# EAGLE design open dmx v.3 (EAGLE 5.06)
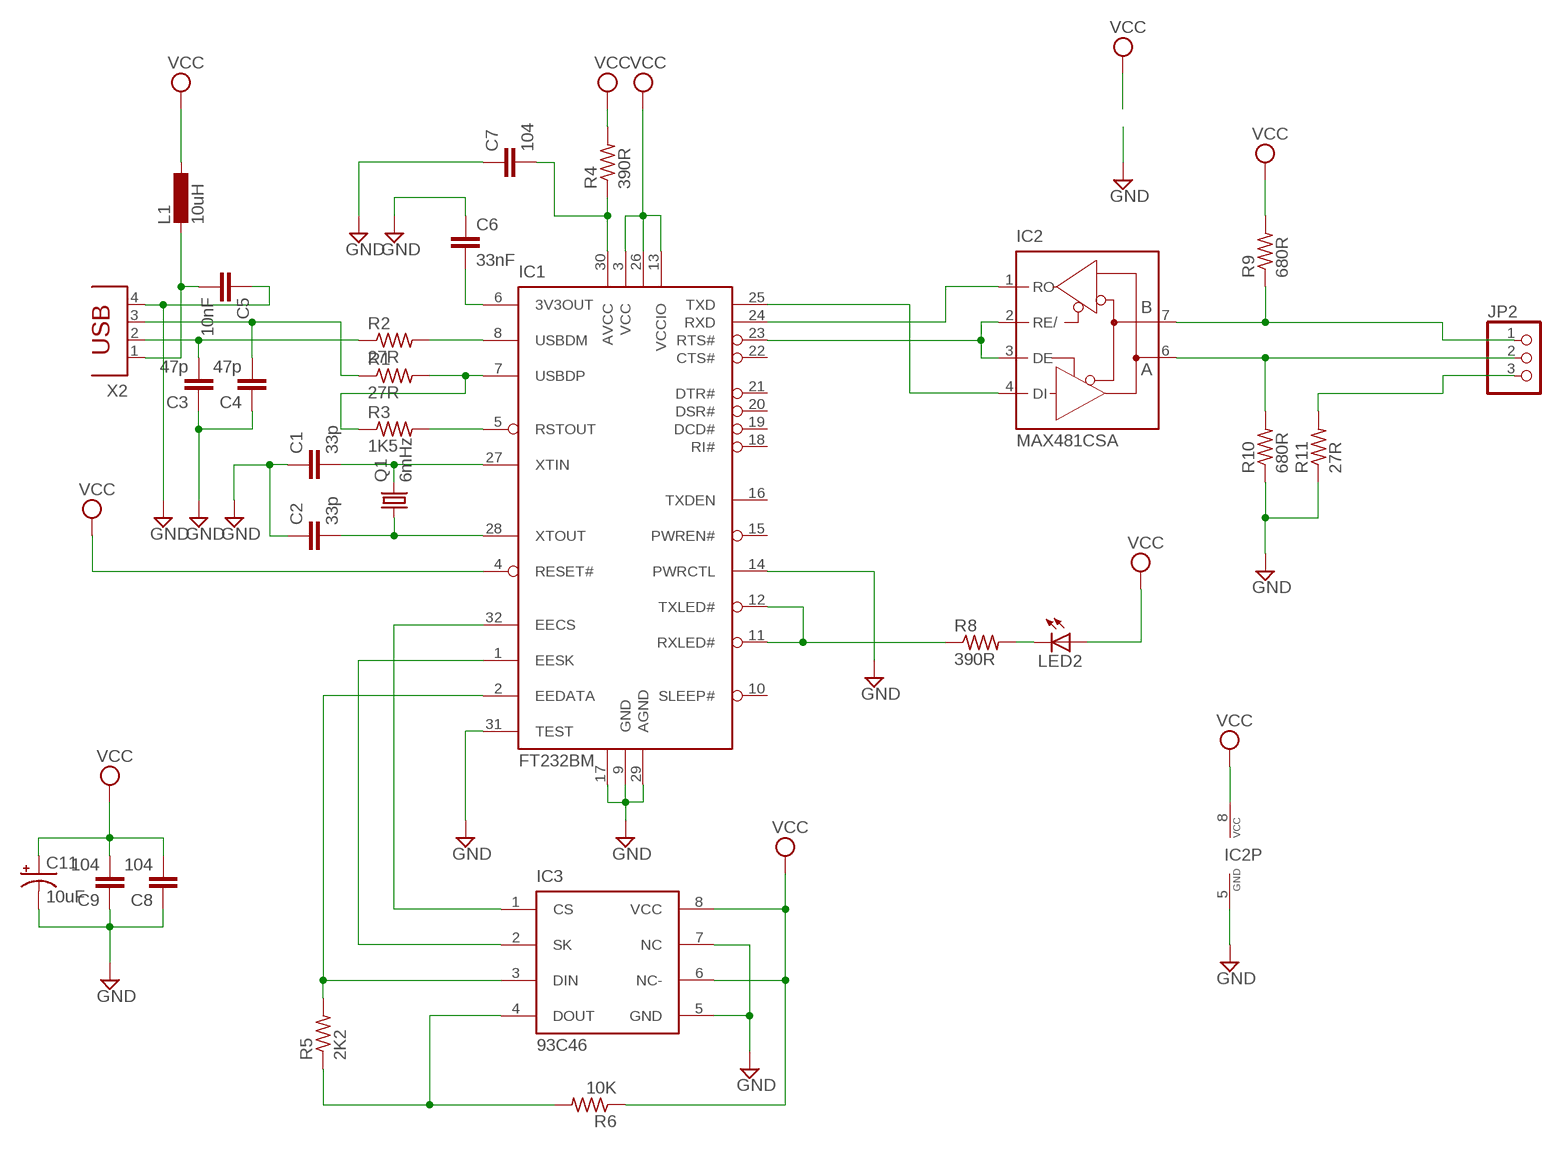
[diagram p0: schematic, sheet 1]

## Parts
C1  33p  C-EUC3216  [C3216]
C2  33p  C-EUC3216  [C3216]
C3  47p  C-EUC3216  [C3216]
C4  47p  C-EUC3216  [C3216]
C5  10nF  C-EUC3216  [C3216]
C6  33nF  C-EUC3216  [C3216]
C7  104  C-EUC3216  [C3216]
C8  104  C-EUC3216  [C3216]
C9  104  C-EUC3216  [C3216]
C11  10uF  CPOL-US153CLV-0605  [153CLV-0605]
IC1  FT232BM  [32LQFP]
IC2  MAX481CSA  [SO08]
IC3  93C46  [SO08]
JP2  PINHD-1X3  [1X03]
L1  10uH  L-EUL3225M  [L3225M]
LED2  LEDCHIPLED_1206  [CHIPLED_1206]
Q1  6mHz  CRYSTALHC49UP  [HC49UP]
R1  27R  R-US_R3216  [R3216]
R2  27R  R-US_R3216  [R3216]
R3  1K5  R-US_R3216  [R3216]
R4  390R  R-US_R3216  [R3216]
R5  2K2  R-US_R3216  [R3216]
R6  10K  R-US_R3216  [R3216]
R8  390R  R-US_R3216  [R3216]
R9  680R  R-US_R3216  [R3216]
R10  680R  R-US_R3216  [R3216]
R11  27R  R-US_R3216  [R3216]
X2  PN61729  [PN61729]

## Nets
GND: C1.1 C2.1 C3.1 C4.1 C5.1 C6.1 C7.1 C8.1 C9.1 C11.- IC1.9(GND) IC1.14(PWRCTL) IC1.17(GND2) IC1.29(AGND) IC1.31(TEST) IC2.5(GND) IC3.5(GND) IC3.7(NC) R10.1 R11.1 X2.4
N$1: C1.2 IC1.27(XTIN) Q1.2
N$2: C2.2 IC1.28(XTOUT) Q1.1
N$3: C4.2 R1.1 X2.3
N$4: IC1.8(USBDM) R2.2
N$5: C3.2 R2.1 X2.2
N$6: IC1.7(USBDP) R1.2 R3.1
N$7: IC1.5(RSTOUT) R3.2
N$8: C5.2 L1.2 X2.1
N$9: C6.2 IC1.6(3V3OUT)
N$11: C7.2 IC1.30(AVCC) R4.1
N$14: IC1.32(EECS) IC3.1(CS)
N$15: IC1.1(EESK) IC3.2(SK)
N$16: IC1.2(EEDATA) IC3.3(DIN) R5.2
N$17: IC3.4(DOUT) R5.1 R6.2
N$21: IC1.11(RXLED#) IC1.12(TXLED#) R8.1
N$22: LED2.C R8.2
N$24: IC1.23(RTS#) IC2.2(RE/) IC2.3(DE)
N$25: IC1.25(TXD) IC2.4(DI)
N$26: IC1.24(RXD) IC2.1(RO)
N$27: IC2.6(A) JP2.2 R10.2
N$28: JP2.3 R11.2
N$29: IC2.7(B) JP2.1 R9.1
VCC: C8.2 C9.2 C11.+ IC1.3(VCC) IC1.4(RESET#) IC1.13(VCCIO) IC1.26(VCC2) IC2.8(VCC) IC3.6(NC-) IC3.8(VCC) L1.1 LED2.A R4.2 R6.1 R9.2
Unconnected: IC1.10(SLEEP#) IC1.15(PWREN#) IC1.16(TXDEN) IC1.18(RI#) IC1.19(DCD#) IC1.20(DSR#) IC1.21(DTR#) IC1.22(CTS#)

## Library data of the parts
C1-C9 = rcl:C-EU: CAPACITOR, European symbol
C11 = rcl:CPOL-US: POLARIZED CAPACITOR, American symbol
IC1 = ftdi4:FT232BM
IC2 = maxim:MAX481CSA: RS485 TRANSEIVER
IC3 = ftdi4:93C46: Serial EEPROM
JP2 = pinhead:PINHD-1X3: PIN HEADER
L1 = rcl:L-EU: INDUCTOR, European symbol
LED2 = led:LED: LED OSRAM: - CHIPLED LG R971, LG N971, LY N971, LG Q971, LY Q971, LO R971, LY R971 LH N974, LH R974 LS Q976, LO Q976, LY Q976 LO Q996 - Hyper CHIPLED LW Q18S LB Q993, LB Q99A, LB R99A - SideLED LS A670, LO A670, LY A670, LG A670, LP A670 LB A673, LV A673, LT A673, LW A673 LH A674 LY A675 LS A676, LA A676, LO A676, LY A676, LW A676 LS A679, LY A679, LG A679 - Hyper Micro SIDELED® LS Y876, LA Y876, LO Y876, LY Y876 LT Y87S - SmartLED LW L88C, LW L88S LB L89C, LB L89S, LG L890 LS L89K, LO L89K, LY L89K LS L896, LA L896, LO L896, LY L896 - TOPLED LS T670, LO T670, LY T670, LG T670, LP T670 LSG T670, LSP T670, LSY T670, LOP T670, LYG T670 LG T671, LOG T671, LSG T671 LB T673, LV T673, LT T673, LW T673 LH T674 LS T676, LA T676, LO T676, LY T676, LB T676, LH T676, LSB T676, LW T676 LB T67C, LV T67C, LT T67C, LS T67K, LO T67K, LY T67K, LW E67C LS E67B, LA E67B, LO E67B, LY E67B, LB E67C, LV E67C, LT E67C LW T67C LS T679, LY T679, LG T679 LS T770, LO T770, LY T770, LG T770, LP T770 LB T773, LV T773, LT T773, LW T773 LH T774 LS E675, LA E675, LY E675, LS T675 LS T776, LA T776, LO T776, LY T776, LB T776 LHGB T686 LT T68C, LB T68C - Hyper Mini TOPLED® LB M676 - Mini TOPLED Santana® LG M470 LS M47K, LO M47K, LY M47K Source: http://www.osram.convergy.de - LUMILED® LXK2-PW12-R00, LXK2-PW12-S00, LXK2-PW14-U00, LXK2-PW14-V00 LXK2-PM12-R00, LXK2-PM12-S00, LXK2-PM14-U00 LXK2-PE12-Q00, LXK2-PE12-R00, LXK2-PE12-S00, LXK2-PE14-T00, LXK2-PE14-U00 LXK2-PB12-K00, LXK2-PB12-L00, LXK2-PB12-M00, LXK2-PB14-N00, LXK2-PB14-P00, LXK2-PB14-Q00 LXK2-PR12-L00, LXK2-PR12-M00, LXK2-PR14-Q00, LXK2-PR14-R00 LXK2-PD12-Q00, LXK2-PD12-R00, LXK2-PD12-S00 LXK2-PH12-R00, LXK2-PH12-S00 LXK2-PL12-P00, LXK2-PL12-Q00, LXK2-PL12-R00 Source: www.luxeon.com
Q1 = crystal:CRYSTAL: CRYSTAL
R1-R6 R8-R11 = resistor:R-US_: RESISTOR, American symbol
X2 = con-berg:PN61729: BERG USB connector

## Board
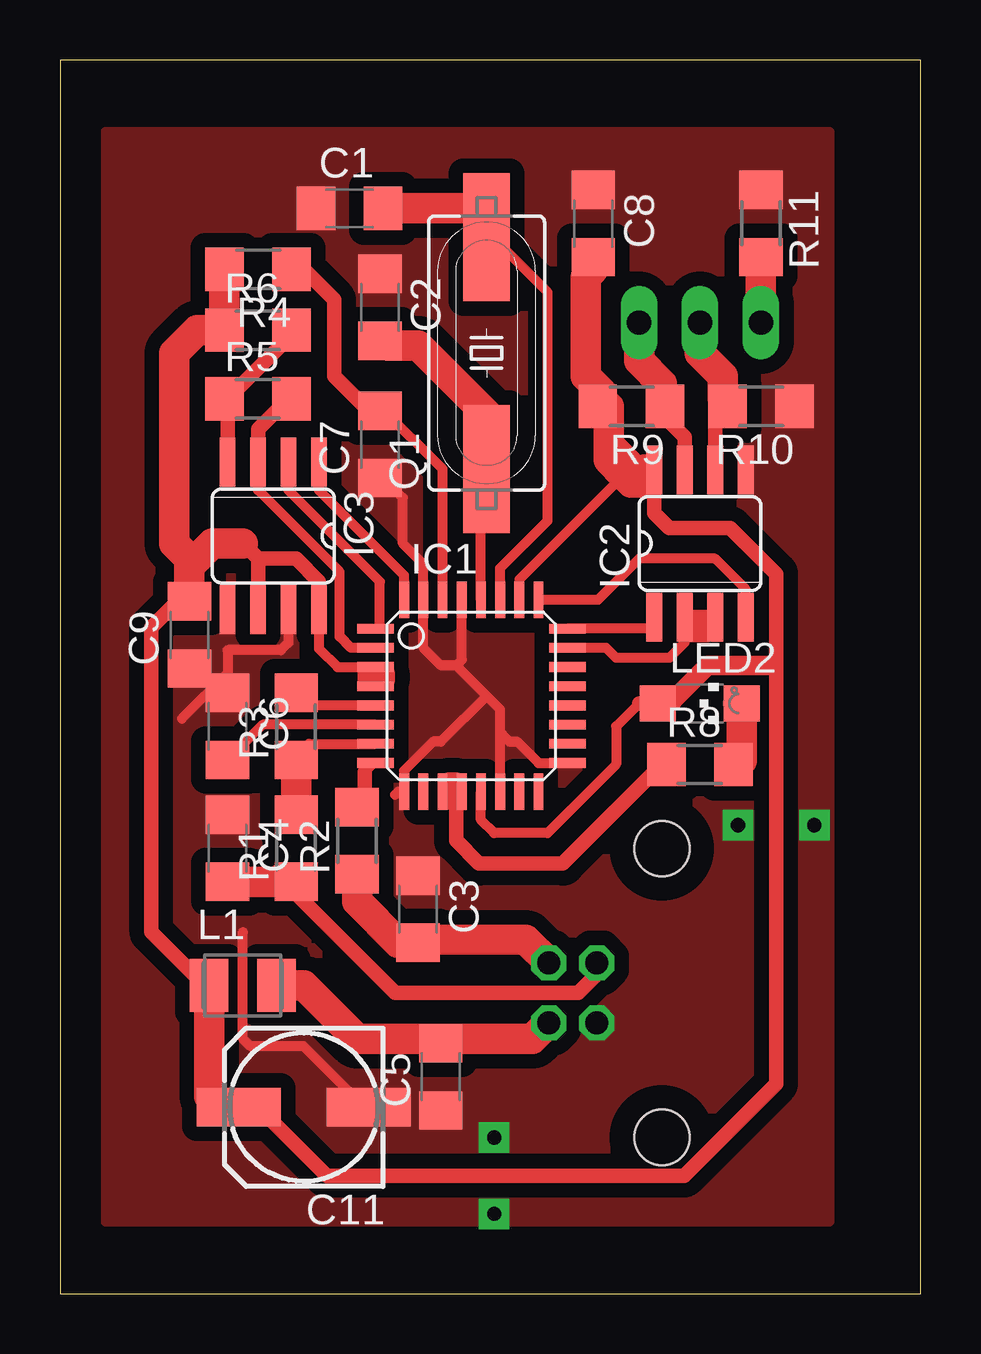
[diagram p1: board, top side]
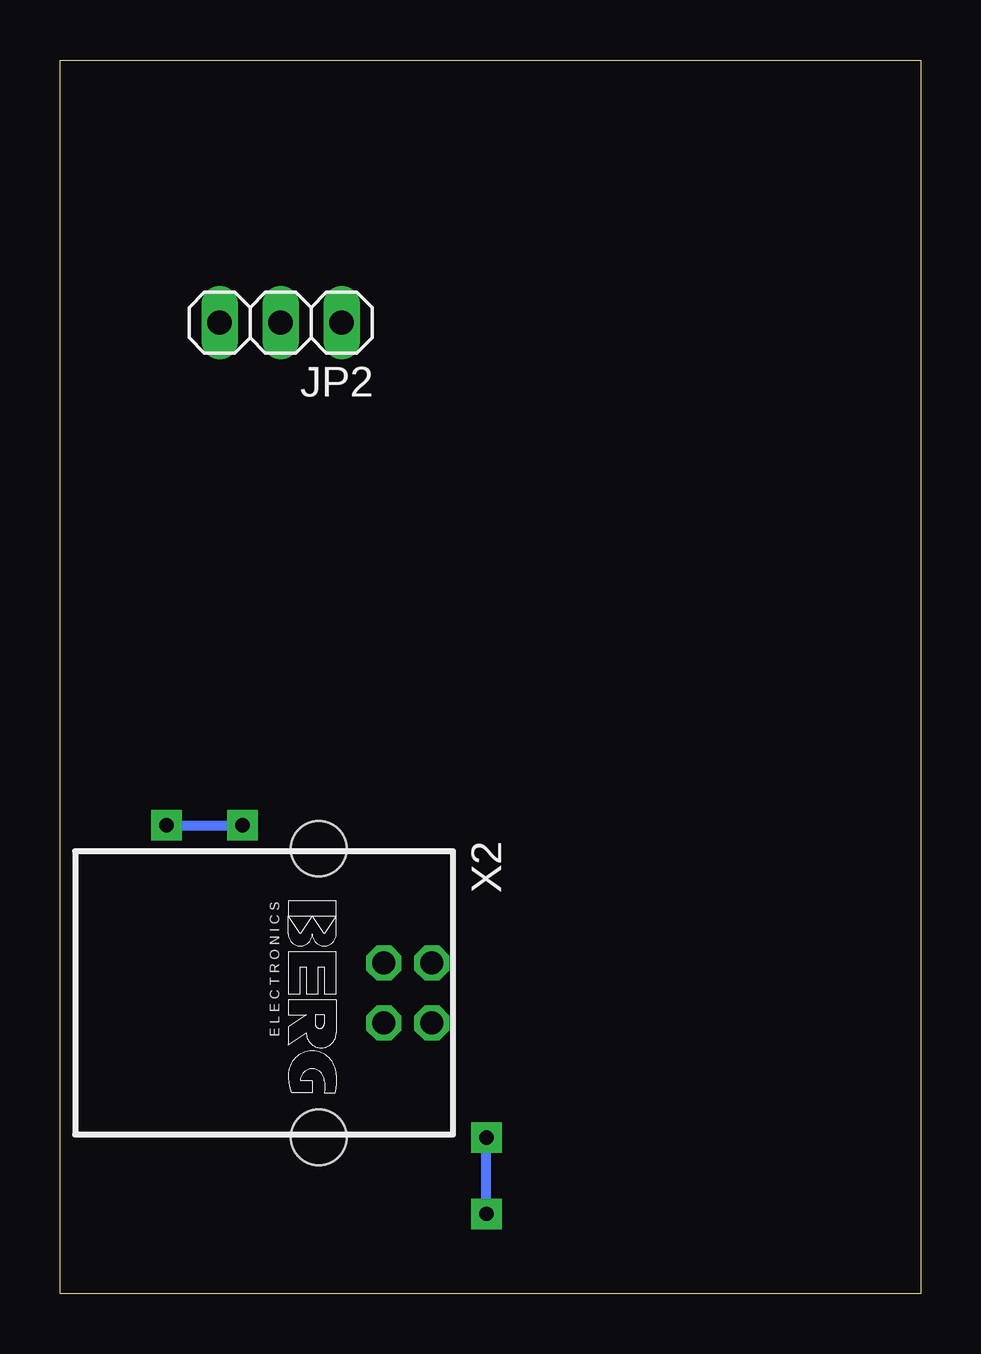
[diagram p2: board, bottom side, seen from below]

Size 35.86 x 51.42 mm. Coordinates in mm from the lower left corner, seen from the top.
Outline: 0,0 35.86,0 35.86,51.42 0,51.42 0,0
Copper layers (1*16): Top 0.035mm / dielectric 1.5mm / Bottom 0.035mm
Design rules "default": minimum track width 10mil, minimum drill 24mil, track to track 8mil, track to pad 8mil, pad to pad 8mil, via to via 8mil, smd to smd 8mil, copper to edge 40mil, drill to drill 8mil, minimum pad ring 10mil, minimum via ring 8mil, stop-mask expansion 4mil, vias tented up to drill 0mil, thermal gap 10mil

### Footprints (pad centres in the part's own frame; a part is rotated, then mirrored left to right if it is on the bottom)
C3216 = smd 1.6 x 1.8: 1 -1.4,0; 2 1.4,0
153CLV-0605 = smd 3.5 x 1.6: + 2.7,0; - -2.7,0
32LQFP = smd 1.524 x 0.406: 1 -4,2.8; 2 -4,2; 3 -4,1.2; 4 -4,0.4; 5 -4,-0.4; 6 -4,-1.2; 7 -4,-2; 8 -4,-2.8; 17 4,-2.8; 18 4,-2; 19 4,-1.2; 20 4,-0.4; 21 4,0.4; 22 4,1.2; 23 4,2; 24 4,2.8 | smd 0.406 x 1.524: 9 -2.8,-4; 10 -2,-4; 11 -1.2,-4; 12 -0.4,-4; 13 0.4,-4; 14 1.2,-4; 15 2,-4; 16 2.8,-4; 25 2.8,4; 26 2,4; 27 1.2,4; 28 0.4,4; 29 -0.4,4; 30 -1.2,4; 31 -2,4; 32 -2.8,4
SO08 = smd 0.66 x 2.032: 1 -1.905,-3.073; 2 -0.635,-3.073; 3 0.635,-3.073; 4 1.905,-3.073; 5 1.905,3.073; 6 0.635,3.073; 7 -0.635,3.073; 8 -1.905,3.073
1X03 = drill 1.016 long: 1 -2.54,0; 2 0,0; 3 2.54,0
L3225M = smd 1.6 x 2.2: 1 -1.4,0; 2 1.4,0
CHIPLED_1206 = smd 1.5 x 1.5: A 0,-1.75; C 0,1.75
HC49UP = smd 5.334 x 1.93: 1 -4.826,0; 2 4.826,0
R3216 = smd 1.6 x 1.8: 1 -1.4,0; 2 1.4,0
PN61729 = drill 0.95 octagon: 1 1.25,4.71; 2 -1.25,4.71; 3 -1.25,2.71; 4 1.25,2.71 | hole 2.3: -6.02,0; 6.02,0

### Placement (x,y rotation side)
C1  12.06,45.24 0 top
C2  13.33,41.11 270 top
C3  14.92,16.03 270 top
C4  6.98,18.57 270 top
C5  15.87,9.04 90 top
C6  6.98,23.65 270 top
C7  13.33,35.39 90 top
C8  22.22,44.6 270 top
C9  5.39,27.46 90 top
C11  10.16,7.77 180 top
IC1  17.14,24.92 0 top
IC2  26.66,31.27 0 top
IC3  8.89,31.58 180 top
JP2  26.66,40.48 180 bottom
L1  7.62,12.85 0 top
LED2  26.66,24.6 270 top
Q1  17.77,39.2 90 top
R1  9.84,18.57 90 top
R2  12.38,18.88 90 top
R3  9.84,23.65 90 top
R4  8.25,42.7 180 top
R5  8.25,37.3 0 top
R6  8.25,40.16 0 top
R8  26.66,22.06 0 top
R9  23.81,36.98 180 top
R10  29.2,36.98 180 top
R11  29.2,44.6 270 top
X2  25.08,12.54 270 bottom

### Tracks (layer width: path | path; a pad name or v marks a point on that pad's centre or on a via)
GND  (via drill 0.6 pad 1.27)
  Top 0.406: IC1.29 16.74,26.42 16.5,26.19 | 16.5,26.19 15.87,26.19 15.14,26.92 IC1.31 15.14,30.41 14.28,31.27 14.28,33.17 13.33,34.12 C7.1 | IC1.14 18.34,23.33 | 18.34,23.33 18.34,24.35 17.77,24.92 | 17.77,24.92 16.5,26.19 | IC1.17 19.94,22.12 19.04,23.01 18.73,23.01 18.41,23.33 18.34,23.33 | 17.77,24.92 15.87,23.01 15.55,23.01 14.34,21.8 IC1.9 14.09,20.92 13.97,20.79 | IC3.7 9.52,27.14 9.2,26.82 6.98,26.82 6.98,25.87 5.08,23.96 | 7.62,15.08 7.62,10.63 7.93,10.31 10.16,10.31 12.7,7.77 C11.-
  Bottom 0.406: v31.43,19.52 v28.25,19.52 | 18.09,3.01 v18.09,3.33 v18.09,6.5
  pour Top (isolate 0.61, no thermals): 32.06,48.41 1.9,48.41 1.9,3.01 32.06,3.01
N$1
  Top 0.406: IC1.27 18.34,30.24 20.31,32.22 20.31,41.74 18.09,43.97 | 18.09,43.97 17.77,44.28 Q1.2 18.03,44.03 18.09,43.97 | 18.09,43.97 18.09,44.6 17.46,45.24 | C1.2 13.33,45.24
  Top 1.27: 17.46,45.24 C1.2
N$2
  Top 0.406: Q1.1 17.14,33.81 17.54,33.41 IC1.28 | 12.7,39.52 12.88,39.71 C2.2
  Top 1.27: Q1.1 17.77,36.66 14.92,39.52 13.65,39.52 13.46,39.71 C2.2
N$3
  Top 0.406: R1.1 9.52,16.98 9.65,16.79 9.2,16.8 9.2,16.98
  Top 0.61: X2.3 22.37,13.32 21.58,12.54 13.97,12.54 9.84,16.66 R1.1
  Top 1.27: R1.1 9.33,17.17 9.2,17.3 9.07,17.17 C4.2
N$4
  Top 0.406: 13.27,22.12 IC1.8 13.07,22.12 12.7,21.74 | R2.2 12.06,20.79
  Top 0.61: 12.06,20.79 12.38,20.79 12.7,20.47 12.7,21.74
N$5
  Top 0.406: 12.38,16.98 12.04,16.96 | R2.1 12.06,17.3 | C3.2 14.73,14.63
  Top 1.27: 14.73,14.63 14.1,14.63 12.38,16.34 12.38,16.98 R2.1 | C3.2 15.24,14.76 19.4,14.74 20.37,13.8 X2.2
N$6
  Top 0.406: IC1.7 10.38,22.92 9.84,22.06
  Top 1.27: R3.1 9.84,22.06 R1.2
N$7
  Top 0.406: R3.2 9.71,25.05 10.24,24.52 IC1.5
N$8
  Top 1.27: X2.1 20.33,11.29 19.68,10.63 15.87,10.63 | 15.87,10.63 C5.2 | L1.2 10.16,12.85 12.38,10.63 15.87,10.63
N$9
  Top 0.406: IC1.6 8.45,23.72 C6.2
N$11
  Top 0.406: C7.2 13.33,36.98 15.94,34.37 IC1.30
  Top 0.61: 13.33,36.98 12.7,36.98 11.43,38.25 11.43,41.43 9.84,43.02 R4.1
N$14
  Top 0.406: IC1.32 14.34,29.94 10.79,33.49 IC3.1
N$15
  Top 0.406: IC3.2 9.52,33.49 13.33,29.68 13.33,27.77 13.27,27.72 IC1.1
N$16
  Top 0.406: 8.25,35.71 IC3.3 8.25,33.49 11.65,30.09 11.65,27.39 12.12,26.92 IC1.2 | 10.16,37.62 9.97,37.8 R5.2
  Top 0.61: 8.25,35.71 8.25,36.03 9.65,37.43 R5.2
N$17
  Top 0.61: 6.98,37.62 R5.1 | IC3.4 6.98,37.62 | R6.2 9.65,39.97 7.3,37.62 6.98,37.62
N$21
  Top 0.406: 16.5,20.79 16.5,20.15 16.19,20.47 | 16.19,20.79 16.06,20.92 IC1.11 16.38,20.92 16.5,20.79 | 25.08,22.06 24.76,22.06 | 16.5,20.79 16.63,20.92 IC1.12
  Top 0.61: 16.5,20.15 16.5,18.88 17.46,17.93 20.95,17.93 25.08,22.06 R8.1 | 16.19,20.47 16.19,21.42 16.5,21.42 16.5,20.79
N$22
  Top 0.61: R8.2 28.25,22.06 28.41,22.22
  Top 1.27: LED2.C 28.25,24.6 28.41,24.44 28.41,22.22
N$24
  Top 0.406: IC1.23 22.76,26.92 23.17,26.5 25.39,26.5 26.03,27.14 26.03,27.46
  Top 0.61: 26.03,28.09 IC2.2 | IC2.3 26.13,28.19 26.03,28.09 | 26.03,28.09 26.35,27.77 26.98,27.77 26.98,27.46 26.03,27.46
N$25
  Top 0.406: IC1.25 22.41,28.92 24.12,30.63 27.3,30.63 28.57,29.36 IC2.4 28.57,27.77
N$26
  Top 0.406: IC2.1 24.76,28.09 24.7,27.72 IC1.24
N$27
  Top 0.61: R10.2 27.62,36.98 27.3,36.66 IC2.6
  Top 1.27: JP2.2 26.66,39.2 27.62,38.25 27.62,37.3 27.8,37.11 R10.2
N$28
  Top 1.27: JP2.3 R11.2
N$29
  Top 0.61: 25.08,36.98 24.76,36.98 26.03,35.71 IC2.7
  Top 1.27: JP2.1 24.12,38.89 25.08,37.94 25.08,36.98 R9.1
VCC
  Top 0.406: IC1.4 13.14,25.42 13.01,25.55 | IC3.6 8.25,28.09 | R9.2 22.86,37.3 | IC1.26 19.14,29.77 23.49,34.12 | IC1.13 17.54,19.75 18.09,19.2 20.31,19.2 23.17,22.06 23.17,23.65 24.12,24.6 | 10.79,28.09 10.79,26.89 11.56,26.12 IC1.3 13.14,26 13.01,25.87 13.33,25.55 | 10.79,29.36 IC3.8 | IC2.8 24.76,34.44 24.66,34.34 24.34,34.34 | L1.1 6.03,12.85
  Top 0.61: IC3.8 10.79,28.09 | 10.79,29.36 10.79,29.68 9.84,30.63 8.25,30.63 | 8.25,30.63 IC3.6 | R4.2 6.85,42.83 6.98,42.7 6.85,42.57 | IC2.8 24.76,32.54 25.39,31.9 27.93,31.9 29.84,30 29.84,26.19 | C11.+ 7.93,8.09 11.11,4.92 26,4.92 29.84,8.75 29.84,26.19 | 24.91,24.75 LED2.A 24.12,24.6 | 7.62,31.27 8.25,30.63 | L1.1 6.34,12.85 6.03,13.17 5.71,13.17 3.8,15.08 3.8,27.77 4.76,28.73 5.08,28.73 5.21,28.86 C9.2 | 13.33,25.55 13.01,25.55 | 13.33,25.55 13.65,25.55 13.65,25.87 13.01,25.87 12.7,25.87 12.7,25.55 13.33,25.55 | 29.84,26.19 29.52,26.19
  Top 0.813: 24.91,24.75 25.55,24.75 26.98,26.19 29.52,26.19
  Top 1.27: 22.86,35.39 22.86,36.98 22.72,37.11 R9.2 22.54,37.3 22.54,37.62 21.9,38.25 21.9,42.38 22.22,42.7 C8.2 | 24.12,34.12 22.86,35.39 | 24.34,34.34 24.12,34.12 | 24.12,34.12 24.12,33.81 23.81,33.81 23.49,34.12 22.86,34.76 22.86,35.39 | L1.1 6.21,8.22 6.66,7.77 C11.+ | 6.85,42.57 6.85,40.34 6.66,40.16 R6.1 5.71,40.16 4.76,39.2 4.76,31.27 5.55,30.47 | C9.2 5.39,30.31 5.55,30.47 | 5.55,30.47 6.34,31.27 7.62,31.27 | 5.55,30.47